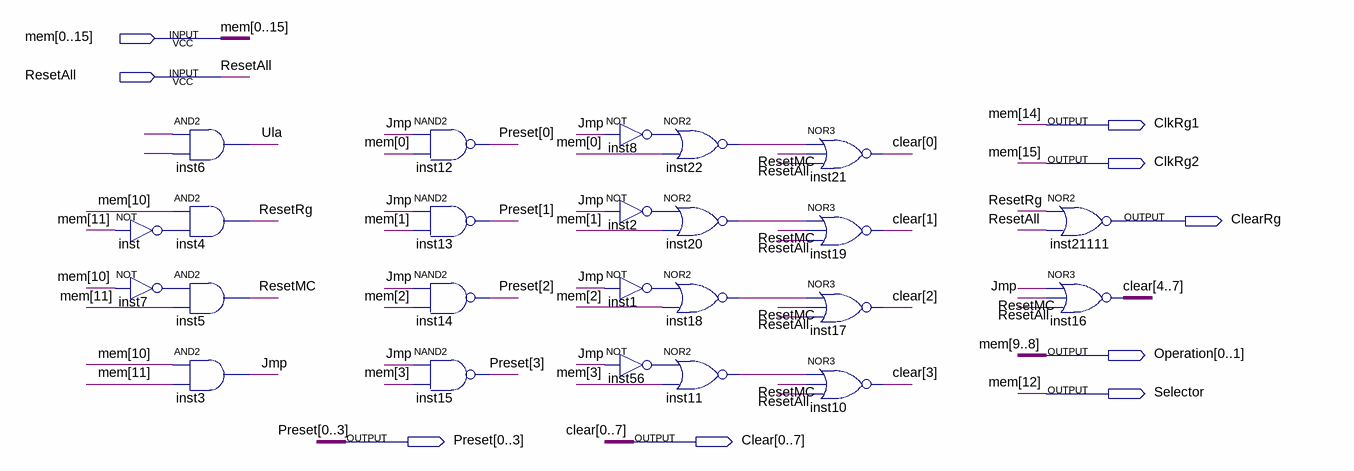
[diagram p0: schematic sheet]
// Quartus schematic uc.bdf as structural Verilog: 24 symbols, 9 pins
module uc (
  input  [0:15] mem,
  input  ResetAll,
  output ClkRg1,
  output ClkRg2,
  output ClearRg,
  output [0:1] Operation,
  output Selector,
  output [0:3] Preset,
  output [0:7] Clear
);

  wire inst1_out, inst2_out, inst7_out, inst8_out, inst11_out, inst18_out, inst20_out, inst22_out,
       inst56_out, inst_out, Jmp, ResetMC, ResetRg, Ula, undriven, undriven_2;

  not inst (inst_out, mem[11]);
  not inst7 (inst7_out, mem[10]);
  and inst6 (Ula, undriven_2, undriven);
  and inst4 (ResetRg, mem[10], inst_out);
  and inst5 (ResetMC, inst7_out, mem[11]);
  and inst3 (Jmp, mem[10], mem[11]);
  nand inst12 (Preset[0], Jmp, mem[0]);
  nand inst13 (Preset[1], Jmp, mem[1]);
  nand inst14 (Preset[2], Jmp, mem[2]);
  nand inst15 (Preset[3], Jmp, mem[3]);
  not inst8 (inst8_out, Jmp);
  nor inst22 (inst22_out, inst8_out, mem[0]);
  not inst2 (inst2_out, Jmp);
  nor inst20 (inst20_out, inst2_out, mem[1]);
  not inst1 (inst1_out, Jmp);
  nor inst18 (inst18_out, inst1_out, mem[2]);
  not inst56 (inst56_out, Jmp);
  nor inst11 (inst11_out, inst56_out, mem[3]);
  nor inst21 (Clear[0], inst22_out, ResetMC, ResetAll);
  nor inst19 (Clear[1], inst20_out, ResetMC, ResetAll);
  nor inst17 (Clear[2], inst18_out, ResetMC, ResetAll);
  nor inst10 (Clear[3], inst11_out, ResetMC, ResetAll);
  nor inst21111 (ClearRg, ResetRg, ResetAll);
  assign Clear[4:7] = ~({4{Jmp}} | {4{ResetMC}} | {4{ResetAll}});  // NOR3 inst16, 4 bits wide

  assign ClkRg1 = mem[14];
  assign ClkRg2 = mem[15];
  assign Operation = {mem[9], mem[8]};
  assign Selector = mem[12];
endmodule
